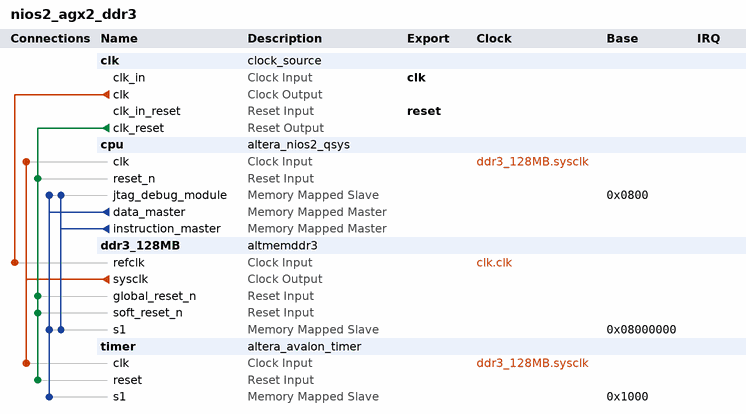
[diagram p0: system contents]
# Platform Designer (Qsys) system nios2_agx2_ddr3
# Parameters at their usual value, and those the tool derives, are not listed.
package require -exact qsys 11.0
create_system nios2_agx2_ddr3
set_project_property DEVICE_FAMILY ARRIAII

add_instance clk clock_source 11.0
set_instance_parameter_value clk clockFrequency 100000000

add_instance cpu altera_nios2_qsys 11.0
set_instance_parameter_value cpu muldiv_divider true
set_instance_parameter_value cpu manuallyAssignCpuID false
set_instance_parameter_value cpu resetSlave ddr3_128MB.s1
set_instance_parameter_value cpu exceptionSlave ddr3_128MB.s1
set_instance_parameter_value cpu breakSlave cpu.jtag_debug_module
set_instance_parameter_value cpu muldiv_multiplierType DSPBlock
set_instance_parameter_value cpu impl Fast
set_instance_parameter_value cpu icache_size 4096
set_instance_parameter_value cpu icache_burstType Sequential
set_instance_parameter_value cpu dcache_bursts true

add_instance ddr3_128MB altmemddr3 11.0
set_instance_parameter_value ddr3_128MB pipeline_commands false
set_instance_parameter_value ddr3_128MB debug_en false
set_instance_parameter_value ddr3_128MB export_debug_port false
set_instance_parameter_value ddr3_128MB use_generated_memory_model true
set_instance_parameter_value ddr3_128MB dedicated_memory_clk_phase_label {Dedicated memory clock phase:}
set_instance_parameter_value ddr3_128MB mem_if_clk_mhz 300.0
set_instance_parameter_value ddr3_128MB quartus_project_exists false
set_instance_parameter_value ddr3_128MB local_if_drate Half
set_instance_parameter_value ddr3_128MB enable_v72_rsu false
set_instance_parameter_value ddr3_128MB local_if_clk_mhz_label 150,0
set_instance_parameter_value ddr3_128MB new_variant true
set_instance_parameter_value ddr3_128MB mem_if_memtype {DDR3 SDRAM}
set_instance_parameter_value ddr3_128MB pll_ref_clk_mhz 100.0
set_instance_parameter_value ddr3_128MB mem_if_clk_ps_label {(3333 ps)}
set_instance_parameter_value ddr3_128MB family {Arria II GX}
set_instance_parameter_value ddr3_128MB project_family {Arria II GX}
set_instance_parameter_value ddr3_128MB speed_grade 4
set_instance_parameter_value ddr3_128MB dedicated_memory_clk_phase 0
set_instance_parameter_value ddr3_128MB pll_ref_clk_ps_label {(10000 ps)}
set_instance_parameter_value ddr3_128MB avalon_burst_length 1
set_instance_parameter_value ddr3_128MB mem_if_clk_pair_count 1
set_instance_parameter_value ddr3_128MB mem_if_cs_per_dimm 1
set_instance_parameter_value ddr3_128MB pre_latency_label {Fix read latency at:}
set_instance_parameter_value ddr3_128MB dedicated_memory_clk_en false
set_instance_parameter_value ddr3_128MB mirror_addressing 0
set_instance_parameter_value ddr3_128MB mem_if_bankaddr_width 3
set_instance_parameter_value ddr3_128MB register_control_word_9 0000
set_instance_parameter_value ddr3_128MB mem_if_rowaddr_width 13
set_instance_parameter_value ddr3_128MB mem_dyn_deskew_en false
set_instance_parameter_value ddr3_128MB post_latency_label {cycles (0 cycles=minimum latency, non-deterministic)}
set_instance_parameter_value ddr3_128MB mem_if_dm_pins_en Yes
set_instance_parameter_value ddr3_128MB local_if_dwidth_label 64
set_instance_parameter_value ddr3_128MB register_control_word_7 0000
set_instance_parameter_value ddr3_128MB register_control_word_8 0000
set_instance_parameter_value ddr3_128MB mem_if_preset {Micron ArriaIIGX_DDR3_Kit(MT41J64M16LA-15E)}
set_instance_parameter_value ddr3_128MB mem_if_pchaddr_bit 10
set_instance_parameter_value ddr3_128MB WIDTH_RATIO 4
set_instance_parameter_value ddr3_128MB vendor Micron
set_instance_parameter_value ddr3_128MB register_control_word_3 0000
set_instance_parameter_value ddr3_128MB register_control_word_4 0000
set_instance_parameter_value ddr3_128MB chip_or_dimm {Discrete Device}
set_instance_parameter_value ddr3_128MB register_control_word_5 0000
set_instance_parameter_value ddr3_128MB register_control_word_6 0000
set_instance_parameter_value ddr3_128MB mem_fmax 667.0
set_instance_parameter_value ddr3_128MB register_control_word_0 0000
set_instance_parameter_value ddr3_128MB register_control_word_size 4
set_instance_parameter_value ddr3_128MB register_control_word_1 0000
set_instance_parameter_value ddr3_128MB register_control_word_2 0000
set_instance_parameter_value ddr3_128MB register_control_word_11 0000
set_instance_parameter_value ddr3_128MB register_control_word_10 0000
set_instance_parameter_value ddr3_128MB mem_if_cs_width 1
set_instance_parameter_value ddr3_128MB mem_if_preset_rlat 0
set_instance_parameter_value ddr3_128MB mem_if_cs_per_rank 1
set_instance_parameter_value ddr3_128MB fast_simulation_en FAST
set_instance_parameter_value ddr3_128MB register_control_word_15 0000
set_instance_parameter_value ddr3_128MB register_control_word_14 0000
set_instance_parameter_value ddr3_128MB mem_if_dwidth 16
set_instance_parameter_value ddr3_128MB mem_if_dq_per_dqs 8
set_instance_parameter_value ddr3_128MB mem_if_coladdr_width 10
set_instance_parameter_value ddr3_128MB register_control_word_13 0000
set_instance_parameter_value ddr3_128MB register_control_word_12 0000
set_instance_parameter_value ddr3_128MB mem_tiha_ps 140
set_instance_parameter_value ddr3_128MB mem_tdsh_ck 0.2
set_instance_parameter_value ddr3_128MB mem_if_trfc_ns 49.5
set_instance_parameter_value ddr3_128MB mem_tqh_ck 0.38
set_instance_parameter_value ddr3_128MB mem_tisa_ps 190
set_instance_parameter_value ddr3_128MB mem_tdss_ck 0.2
set_instance_parameter_value ddr3_128MB mem_trtp_ns 7.5
set_instance_parameter_value ddr3_128MB mem_if_tinit_us 500.0
set_instance_parameter_value ddr3_128MB mem_if_trcd_ns 13.5
set_instance_parameter_value ddr3_128MB mem_if_twtr_ck 4
set_instance_parameter_value ddr3_128MB mem_trrd_ns 7.5
set_instance_parameter_value ddr3_128MB mem_tdqss_ck 0.25
set_instance_parameter_value ddr3_128MB mem_tqhs_ps 300
set_instance_parameter_value ddr3_128MB mem_tdsa_ps 65
set_instance_parameter_value ddr3_128MB mem_tac_ps 400
set_instance_parameter_value ddr3_128MB mem_tdha_ps 30
set_instance_parameter_value ddr3_128MB mem_if_tras_ns 36.0
set_instance_parameter_value ddr3_128MB mem_if_twr_ns 15.0
set_instance_parameter_value ddr3_128MB mem_tdqsck_ps 255
set_instance_parameter_value ddr3_128MB mem_if_trp_ns 13.5
set_instance_parameter_value ddr3_128MB mem_tdqsq_ps 125
set_instance_parameter_value ddr3_128MB mem_if_tmrd_ns 6.0
set_instance_parameter_value ddr3_128MB mem_tfaw_ns 45.0
set_instance_parameter_value ddr3_128MB mem_if_trefi_us 7.8
set_instance_parameter_value ddr3_128MB mem_tcl_40_fmax 533.0
set_instance_parameter_value ddr3_128MB mem_odt Disabled
set_instance_parameter_value ddr3_128MB mp_WLH_percent 0.6
set_instance_parameter_value ddr3_128MB mem_drv_str Normal
set_instance_parameter_value ddr3_128MB mp_DH_percent 0.5
set_instance_parameter_value ddr3_128MB input_period 0
set_instance_parameter_value ddr3_128MB mp_QH_percent 0.5
set_instance_parameter_value ddr3_128MB mp_QHS_percent 0.5
set_instance_parameter_value ddr3_128MB mem_tcl_30_fmax 533.0
set_instance_parameter_value ddr3_128MB ac_clk_select 90
set_instance_parameter_value ddr3_128MB mp_DQSQ_percent 0.65
set_instance_parameter_value ddr3_128MB mp_DS_percent 0.6
set_instance_parameter_value ddr3_128MB pll_reconfig_ports_en false
set_instance_parameter_value ddr3_128MB mem_btype Sequential
set_instance_parameter_value ddr3_128MB mp_IS_percent 0.7
set_instance_parameter_value ddr3_128MB mem_tcl 9.0
set_instance_parameter_value ddr3_128MB mp_DQSS_percent 0.5
set_instance_parameter_value ddr3_128MB export_bank_info false
set_instance_parameter_value ddr3_128MB mp_DSS_percent 0.6
set_instance_parameter_value ddr3_128MB mem_dll_en Yes
set_instance_parameter_value ddr3_128MB ac_phase 90
set_instance_parameter_value ddr3_128MB mem_if_oct_en false
set_instance_parameter_value ddr3_128MB mem_tcl_60_fmax 400.0
set_instance_parameter_value ddr3_128MB mp_DSH_percent 0.6
set_instance_parameter_value ddr3_128MB mem_if_dqsn_en true
set_instance_parameter_value ddr3_128MB enable_mp_calibration true
set_instance_parameter_value ddr3_128MB mp_IH_percent 0.6
set_instance_parameter_value ddr3_128MB mem_tcl_15_fmax 533.0
set_instance_parameter_value ddr3_128MB dll_external false
set_instance_parameter_value ddr3_128MB mem_bl {On the fly}
set_instance_parameter_value ddr3_128MB mp_WLS_percent 0.7
set_instance_parameter_value ddr3_128MB mem_tcl_50_fmax 80.0
set_instance_parameter_value ddr3_128MB mp_DQSCK_percent 0.5
set_instance_parameter_value ddr3_128MB mem_tcl_25_fmax 533.0
set_instance_parameter_value ddr3_128MB mem_tcl_20_fmax 533.0
set_instance_parameter_value ddr3_128MB cfg_reorder_data true
set_instance_parameter_value ddr3_128MB ctl_ecc_en false
set_instance_parameter_value ddr3_128MB ctl_hrb_en false
set_instance_parameter_value ddr3_128MB ref_clk_source clk
set_instance_parameter_value ddr3_128MB cfg_data_reordering_type INTER_BANK
set_instance_parameter_value ddr3_128MB ctl_powerdn_en false
set_instance_parameter_value ddr3_128MB multicast_wr_en false
set_instance_parameter_value ddr3_128MB auto_powerdn_cycles 0
set_instance_parameter_value ddr3_128MB ctl_self_refresh_en false
set_instance_parameter_value ddr3_128MB cfg_starve_limit 10
set_instance_parameter_value ddr3_128MB ctl_latency 0
set_instance_parameter_value ddr3_128MB tool_context SOPC_BUILDER
set_instance_parameter_value ddr3_128MB mem_addr_mapping CHIP_ROW_BANK_COL
set_instance_parameter_value ddr3_128MB burst_merge_en false
set_instance_parameter_value ddr3_128MB user_refresh_en false
set_instance_parameter_value ddr3_128MB qsys_mode true
set_instance_parameter_value ddr3_128MB clk_source_sharing_en false
set_instance_parameter_value ddr3_128MB ctl_lookahead_depth 4
set_instance_parameter_value ddr3_128MB ctl_autopch_en false
set_instance_parameter_value ddr3_128MB ctl_dynamic_bank_allocation false
set_instance_parameter_value ddr3_128MB ctl_dynamic_bank_num 4
set_instance_parameter_value ddr3_128MB local_if_type_avalon true
set_instance_parameter_value ddr3_128MB csr_en false
set_instance_parameter_value ddr3_128MB ctl_auto_correct_en false
set_instance_parameter_value ddr3_128MB auto_powerdn_en false
set_instance_parameter_value ddr3_128MB phy_if_type_afi true
set_instance_parameter_value ddr3_128MB controller_type ngv110_ctl
set_instance_parameter_value ddr3_128MB max_local_size 4
set_instance_parameter_value ddr3_128MB mem_srtr Normal
set_instance_parameter_value ddr3_128MB mem_mpr_loc {Predefined Pattern}
set_instance_parameter_value ddr3_128MB dss_tinit_rst_us 200.0
set_instance_parameter_value ddr3_128MB mem_tcl_90_fmax 533.333
set_instance_parameter_value ddr3_128MB mem_rtt_wr {Dynamic ODT off}
set_instance_parameter_value ddr3_128MB mem_tcl_100_fmax 80.0
set_instance_parameter_value ddr3_128MB mem_pasr {Full Array}
set_instance_parameter_value ddr3_128MB mem_asrm {Manual SR Reference (SRT)}
set_instance_parameter_value ddr3_128MB mem_mpr_oper {Predefined Pattern}
set_instance_parameter_value ddr3_128MB mem_tcl_80_fmax 533.333
set_instance_parameter_value ddr3_128MB mem_drv_impedance RZQ/7
set_instance_parameter_value ddr3_128MB mem_rtt_nom RZQ/6
set_instance_parameter_value ddr3_128MB mem_tcl_70_fmax 533.333
set_instance_parameter_value ddr3_128MB mem_wtcl 7.0
set_instance_parameter_value ddr3_128MB mem_dll_pch {Fast exit}
set_instance_parameter_value ddr3_128MB mem_atcl Disabled
set_instance_parameter_value ddr3_128MB board_settings_valid true
set_instance_parameter_value ddr3_128MB t_IH 0.219
set_instance_parameter_value ddr3_128MB board_intra_DQS_group_skew 0.02
set_instance_parameter_value ddr3_128MB isi_DQS 0.0
set_instance_parameter_value ddr3_128MB addr_cmd_slew_rate 3.47
set_instance_parameter_value ddr3_128MB board_tpd_inter_DIMM 0.05
set_instance_parameter_value ddr3_128MB board_addresscmd_CK_skew 0.0
set_instance_parameter_value ddr3_128MB t_DS_calculated 0,192
set_instance_parameter_value ddr3_128MB isi_addresscmd_hold 0.0
set_instance_parameter_value ddr3_128MB t_IS 0.203
set_instance_parameter_value ddr3_128MB restore_default_toggle false
set_instance_parameter_value ddr3_128MB dqs_dqsn_slew_rate 4.103
set_instance_parameter_value ddr3_128MB dq_slew_rate 1.75
set_instance_parameter_value ddr3_128MB board_inter_DQS_group_skew 0.02
set_instance_parameter_value ddr3_128MB isi_addresscmd_setup 0.0
set_instance_parameter_value ddr3_128MB board_minCK_DQS_skew -0.01
set_instance_parameter_value ddr3_128MB t_IS_calculated 0,203
set_instance_parameter_value ddr3_128MB num_slots_or_devices 1
set_instance_parameter_value ddr3_128MB board_maxCK_DQS_skew 0.01
set_instance_parameter_value ddr3_128MB board_skew_ps 20
set_instance_parameter_value ddr3_128MB t_DH 0.164
set_instance_parameter_value ddr3_128MB ck_ckn_slew_rate 4.853
set_instance_parameter_value ddr3_128MB isi_DQ 0.0
set_instance_parameter_value ddr3_128MB t_IH_calculated 0,219
set_instance_parameter_value ddr3_128MB t_DH_calculated 0,164
set_instance_parameter_value ddr3_128MB t_DS 0.193

add_instance timer altera_avalon_timer 11.0
set_instance_parameter_value timer period 1
set_instance_parameter_value timer periodUnits MSEC
set_instance_parameter_value timer timerPreset CUSTOM

# connections
add_connection clk.clk ddr3_128MB.refclk clock
add_connection ddr3_128MB.sysclk cpu.clk clock
add_connection ddr3_128MB.sysclk timer.clk clock
add_connection clk.clk_reset cpu.reset_n reset
add_connection clk.clk_reset ddr3_128MB.global_reset_n reset
add_connection clk.clk_reset ddr3_128MB.soft_reset_n reset
add_connection clk.clk_reset timer.reset reset
add_connection cpu.data_master cpu.jtag_debug_module avalon
set_connection_parameter_value cpu.data_master/cpu.jtag_debug_module baseAddress 0x0800
add_connection cpu.data_master ddr3_128MB.s1 avalon
set_connection_parameter_value cpu.data_master/ddr3_128MB.s1 baseAddress 0x08000000
add_connection cpu.data_master timer.s1 avalon
set_connection_parameter_value cpu.data_master/timer.s1 baseAddress 0x1000
add_connection cpu.instruction_master cpu.jtag_debug_module avalon
set_connection_parameter_value cpu.instruction_master/cpu.jtag_debug_module baseAddress 0x0800
add_connection cpu.instruction_master ddr3_128MB.s1 avalon
set_connection_parameter_value cpu.instruction_master/ddr3_128MB.s1 baseAddress 0x08000000

# exported interfaces
add_interface clk clock sink
set_interface_property clk EXPORT_OF clk.clk_in
add_interface reset reset sink
set_interface_property reset EXPORT_OF clk.clk_in_reset

save_system nios2_agx2_ddr3.qsys
